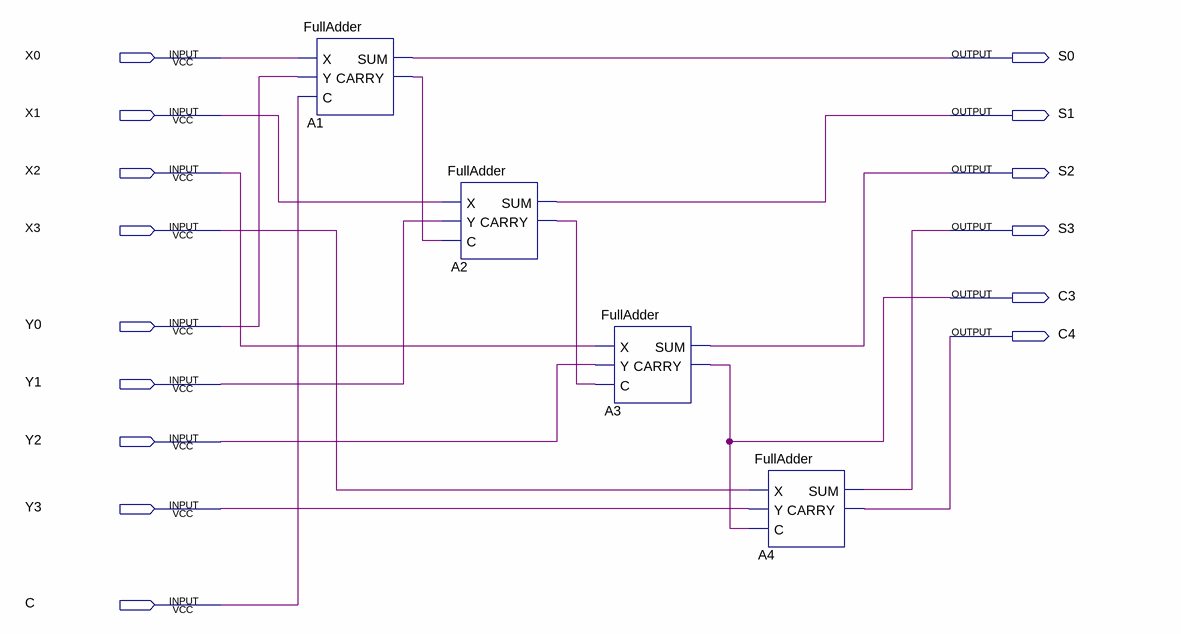
[diagram p0: schematic sheet]
// Quartus schematic 4bitAdderV2.bdf as structural Verilog: 4 symbols, 15 pins
module \4bitAdderV2  (
  input  X0,
  input  X1,
  input  X2,
  input  X3,
  input  Y0,
  input  Y1,
  input  Y2,
  input  Y3,
  input  C,
  output S0,
  output S1,
  output S2,
  output S3,
  output C3,
  output C4
);

  wire A1_carry, A2_carry;

  FullAdder A1 (.X(X0), .Y(Y0), .C(C), .SUM(S0), .CARRY(A1_carry));
  FullAdder A2 (.X(X1), .Y(Y1), .C(A1_carry), .SUM(S1), .CARRY(A2_carry));
  FullAdder A3 (.X(X2), .Y(Y2), .C(A2_carry), .SUM(S2), .CARRY(C3));
  FullAdder A4 (.X(X3), .Y(Y3), .C(C3), .SUM(S3), .CARRY(C4));
endmodule
